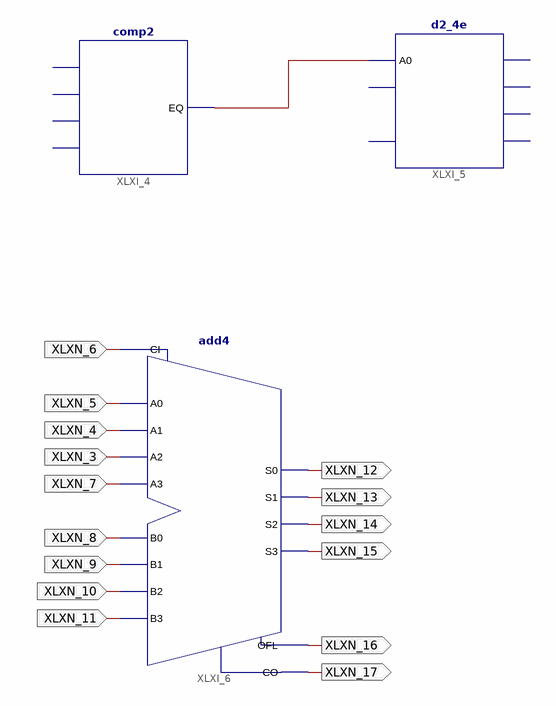
[diagram p0: schematic sheet 1]
// Xilinx ISE schematic demo.sch (spartan3e) as structural Verilog: 3 symbols, 15 ports
module demo (
  input  XLXN_3,
  input  XLXN_4,
  input  XLXN_5,
  input  XLXN_6,
  input  XLXN_7,
  input  XLXN_8,
  input  XLXN_9,
  input  XLXN_10,
  input  XLXN_11,
  output XLXN_12,
  output XLXN_13,
  output XLXN_14,
  output XLXN_15,
  output XLXN_16,
  output XLXN_17
);

  wire XLXN_2;

  comp2 XLXI_4 (.EQ(XLXN_2));  // open: A0, A1, B0, B1
  d2_4e XLXI_5 (.A0(XLXN_2));  // open: A1, E, D0, D1, D2, D3
  add4 XLXI_6 (
    .A0(XLXN_5), .A1(XLXN_4), .A2(XLXN_3), .A3(XLXN_7), .B0(XLXN_8), .B1(XLXN_9), .B2(XLXN_10), .B3(XLXN_11),
    .CI(XLXN_6), .CO(XLXN_17), .OFL(XLXN_16), .S0(XLXN_12), .S1(XLXN_13), .S2(XLXN_14), .S3(XLXN_15));
endmodule
